# Altium project PDB_Board.PrjPcb
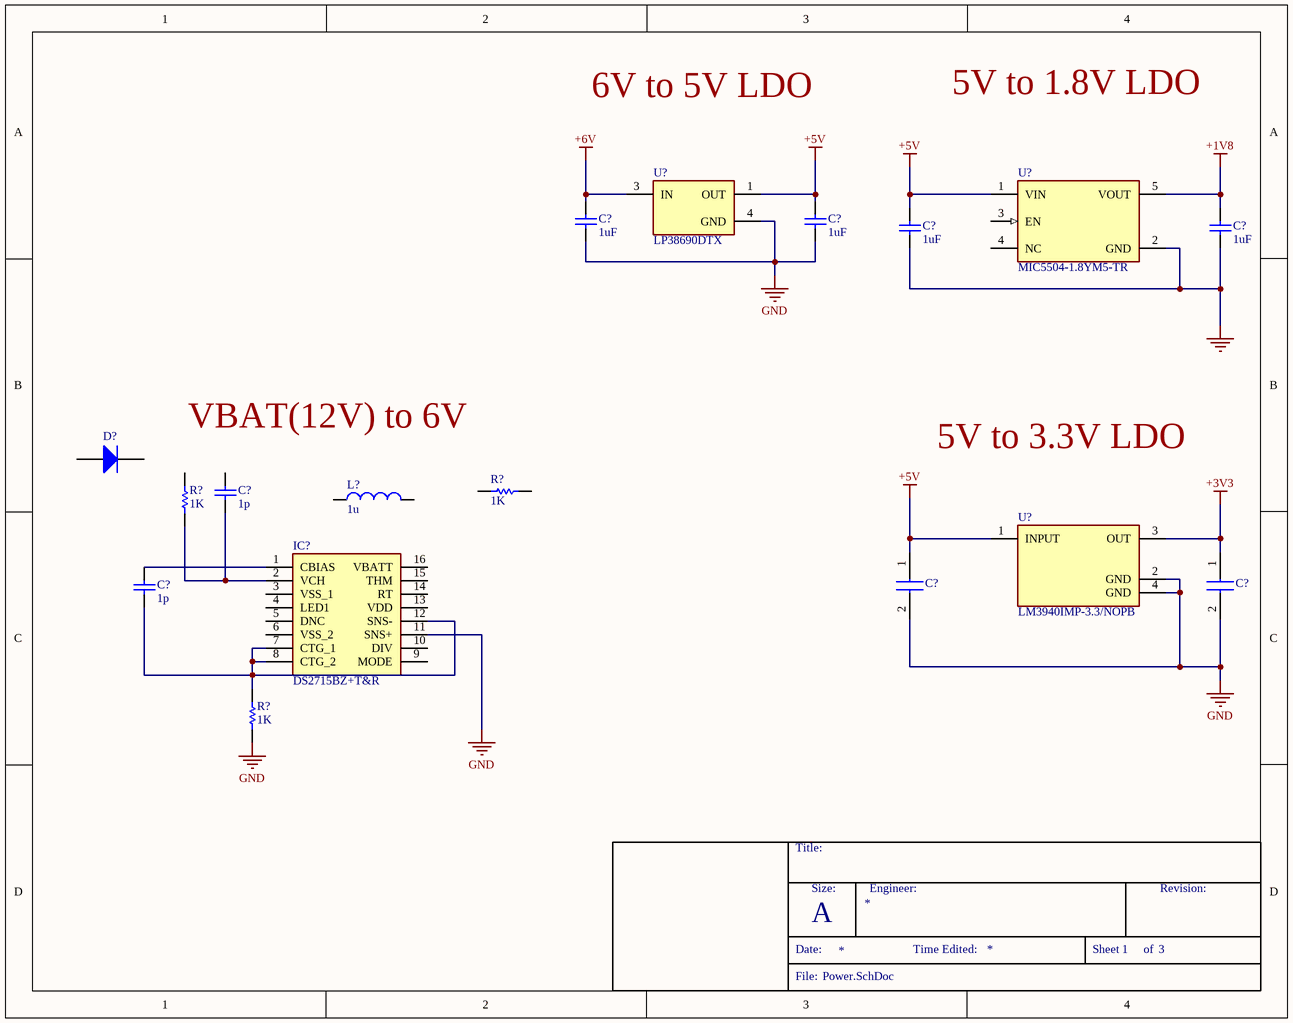
[diagram p0: Power.SchDoc]
CAGE_CODE: ?????; CONTRACT_NUMBER: <CONTRACT NO>; DOC_NO_ASSY_DWG: <ASSY DWG NO>; DOC_NO_BOM: <BOM DOC NO>; DOC_NO_FAB_DWG: <FAB DWG NO>; DOC_NO_SCH_DWG: <SCH DWG NO>; PCB_2_DEC_TOL: +/-.01; PCB_3_DEC_TOL: +/-.010; PCB_ANG_TOL: +/-1/2; PCB_ASSEMBLY_NO: <PCB ASSY NO>; PCB_CHECKER: - -----; PCB_CHECKER_APP_DATE: --/--/----; PCB_DESIGNER: - -----; PCB_DESIGNER_APP_DATE: --/--/----; PCB_DWG_NO: <PCB DWG NO>; PCB_ENGINEER: - -----; PCB_ENGINEER_APP_DATE: --/--/----; PCB_PART_NUMBER: <PCB PN>; PCB_REV: A; SCH_REV: A
3 sheets, 52 parts. Net scope: global (net labels, ports and power ports of the same name join across sheets).
Board file: Power_PCB.PcbDoc
Sheets:
  Power.SchDoc
  Battery.SchDoc
  PDB_Connectors.SchDoc

## Sheet Power.SchDoc
size A; ENG_APP_DATE: --/--/--; DSN_APP_DATE: --/--/--; CHK_APP_DATE: --/--/--; Organization: My Company; Address1: Address Line 1; Address2: Address Line 2; Address3: Address Line 3; Address4: Address Line 4; SheetNumber: 1; SheetTotal: 3

### Parts
(Parts that share a designator on the sheet are numbered #1, #2 ... from top to bottom, then left to right.)
C?#1  1uF  [CAPC1608X87X35LL15T15]
C?#2  1uF  [CAPC1608X87X35LL15T15]
C?#3  1uF  [CAPC1608X87X35LL15T15]
C?#4  1uF  [CAPC1608X87X35LL15T15]
C?#5  value 1p  (hidden comment: Capacitor)
C?#6  C2012X5R0J336M125AC  [CAPC2012X145N]  (value not drawn)
C?#7  C2012X5R0J336M125AC  [CAPC2012X145N]  (value not drawn)
C?#8  value 1p  (hidden comment: Capacitor)
D?#1  Diode  (value not drawn)
IC?#1  DS2715BZ+T&R  [SOIC127P1032X265-16N]
L?#1  value 1u  (hidden comment: Inductor)
R?#1  value 1K  (hidden comment: Resistor)
R?#2  value 1K  (hidden comment: Resistor)
R?#3  value 1K  (hidden comment: Resistor)
U?#1  LP38690DTX  [FP-NDP0003B-MFG]
U?#2  MIC5504-1.8YM5-TR  [FP-SOT23-5LD-PL-1-MFG]
U?#3  LM3940IMP-3.3/NOPB  [FP-DCY0004A-MFG]

### Nets
+1V8: C?#4.2 U?#2.5(VOUT)
+3V3: C?#7.1 U?#3.3(OUT)
+5V: C?#2.2 C?#3.2 C?#6.1 U?#1.1(OUT) U?#2.1(VIN) U?#3.1(INPUT)
+6V: C?#1.2 U?#1.3(IN)
GND: C?#1.1 C?#2.1 C?#3.1 C?#4.1 C?#6.2 C?#7.2 IC?#1.11(SNS+) R?#3.1 U?#1.4(GND) U?#2.2(GND) U?#3.2(GND) U?#3.4(GND)
NetC?#5_1: C?#5.1 IC?#1.2(VCH) R?#2.1
NetC?#8_1: C?#8.1 IC?#1.7(CTG_1) IC?#1.8(CTG_2) IC?#1.12(SNS-) R?#3.2
NetC?#8_2: C?#8.2 IC?#1.1(CBIAS)

Not connected (* = marked no-connect by the designer): C?#5 2; D?#1 1(A) 2(K); IC?#1 3(VSS_1) 4(LED1) 5(DNC) 6(VSS_2) 9(MODE) 10(DIV) 13(VDD) 14(RT) 15(THM) 16(VBATT); L?#1 1 2; R?#1 1 2; R?#2 2; U?#2 3(EN) 4(NC)

### Notes on the sheet
- 6V to 5V LDO
- 5V to 1.8V LDO
- VBAT(12V) to 6V
- 5V to 3.3V LDO
- Title:
- Size:
- Engineer:
- Revision:
- Date:
- A
- Time Edited:
- Sheet
- of
- File:

### Library data of the parts
C?#1-C?#4 = CMP-2006-03713-1: Part Number: C0603C105K3RACTU; Manufacturer: Kemet
C?#5 C?#8 = Capacitor: SimulationGenericComponent: True
C?#6 C?#7 = C2012X5R0J336M125AC: Capacitor; Manufacturer_Name: TDK; Datasheet Link: https://product.tdk.com/info/en/catalog/datasheets/mlcc_commercial_midvoltage_en.pdf; Height: 1.45mm; Manufacturer_Part_Number: C2012X5R0J336M125AC; Mouser Part Number: 810-C2012X5R0J336M; Mouser Price/Stock: https://www.mouser.co.uk/ProductDetail/TDK/C2012X5R0J336M125AC?qs=dfay7wIA1uEz8IOrvQUw5Q%3D%3D; Arrow Part Number: C2012X5R0J336M125AC; Arrow Price/Stock: https://www.arrow.com/en/products/c2012x5r0j336m125ac/tdk?region=nac
D?#1 = Diode: AF: 1; BV: 0; BV_MAX: 1e99; EG: 1.11; FC: 0.5; IBV: 0.001; ISR: 1e-14; MJSW: 0.33; NTUN: 30; TNOM: 27; XTI: 3; SimulationGenericComponent: True; CJO: 0; CJP: 0; CTA: 0; CTP: 0; FCS: 0.5; FV_MAX: 1e99; IKF: 0; IKR: 0; JSW: 0; JTUN: 0; JTUNSW: 0; KEG: 1; KF: 0; LEVEL: 1; N: 1; NBV: 1; NR: 1; NS: 1; PHP: 1; RS: 0; TCV: 0; TLEV: 0; TLEVC: 0; TM1: 0; TM2: 0; TPB: 0; TPHP: 0; TRS: 0; TRS2: 0; TT: 0; TTT1: 0; TTT2: 0; VJ: 1; XTITUN: 3; IS: 1e-14
IC?#1 = DS2715BZ+T&R: Integrated Circuit; Manufacturer_Name: Analog Devices; Datasheet Link: https://www.mouser.in/datasheet/2/256/DS2715-1389140.pdf; Height: 2.65mm; Manufacturer_Part_Number: DS2715BZ+T&R; Mouser Part Number: 700-DS2715BZT&R; Mouser Price/Stock: https://www.mouser.co.uk/ProductDetail/Maxim-Integrated/DS2715BZ%2bTR?qs=LHmEVA8xxfZnvZMuot3c2Q%3D%3D
L?#1 = Inductor: SimulationGenericComponent: True
R?#1-R?#3 = Resistor: TC1: 0; SimulationGenericComponent: True; TC2: 0
U?#1 = CMP-04917-000019-1: IC REG LINEAR 3.3V 1A TO252-3 / LP38690DTX-3.3_NOPB; Manufacturer: Texas Instruments; Manufacturer Part Number: LP38690DTX-3.3/NOPB; Max Junction Temp: +125°C; Nominal Supply Current: 55uA; Number Of Outputs: 1; Dropout Voltage: 650mV; Standoff Height: 0.17mm; Accuracy Percentage: 2.5%; Max Supply Voltage: 10V; Min Supply Voltage: 2.7V; Output Type: Fixed; Digikey Description: IC REG LINEAR 3.3V 1A TO252-3; Device Class L1: Integrated Circuits (ICs); Mouser Description: LDO Voltage Regulators 1A LDO CMOS Linear Regs Stable; Device Class L3: Voltage Regulators - Linear; Output Voltage: 3.3V; Lead Free: Yes; ComponentLink2Description: Datasheet; Height: 2.72mm; Temperature Range Low: -40°C; Temperature: -40°C to +125°C; Device Class L2: Power Management ICs; Temperature Range High: +125°C; RoHS: TRUE; Octopart: https://octopart.com/lp38690dtx-3.3%2Fnopb-texas+instruments-24816519; Automotive: No; Category: IC; Output Current: 1A; Package: NDP0003B; ComponentLink2URL: http://www.ti.com/lit/ds/symlink/lp38690.pdf
U?#2 = CMP-06324-000021-1: IC REG LINEAR 1.8V 300MA SOT23-5; Manufacturer: Microchip; Dropout Voltage: 160mV; Number Of Outputs: 1; Nominal Supply Current: 38-42uA; Accuracy Percentage: 2%; Max Supply Voltage: 5.5V; Max Junction Temp: +125°C; Min Supply Voltage: 2.5V; Standoff Height: 0mm; Output Type: Fixed; Temperature Range Low: -40°C; Temperature Range High: +125°C; Automotive: No; Octopart: https://octopart.com/mic5504-1.8ym5-tr-microchip-66803399; RoHS: TRUE; Device Class L1: Integrated Circuits (ICs); Device Class L3: Voltage Regulators - Linear; Package: SOT23-5LD-PL-1; Device Class L2: Power Management ICs; Output Current: 300mA; Digikey Description: IC REG LINEAR 1.8V 300MA SOT23-5; Lead Free: Yes; Output Voltage: 1.8V; Height: 1.45mm; Category: IC; ComponentLink2Description: Datasheet; Temperature: -40°C to +125°C; ComponentLink2URL: http://ww1.microchip.com/downloads/en/DeviceDoc/MIC5501-02-03-04-300mA-Single-Output-LDO-in-Small-Packages-DS20006006B.pdf; Manufacturer Part Number: MIC5504-1.8YM5-TR
U?#3 = CMP-0062-01788-4: IC REG LINEAR 3.3V 1A SOT223-4; Min Input Voltage: 4.5V; Max Supply Voltage: 7.5V; Number of Outputs: 1; Output Type: Fixed; Polarity: Positive; Dropout Voltage: 500mV; Quiescent Current: 15mA; Max Output Voltage: 3.3V; Length: 6.5mm; Termination: SMD/SMT; Width: 3.56mm; Min Supply Voltage: 4.5V; Max Output Current: 1A; Case/Package: SOT-223; Output Voltage: 3.3V; Current Rating: 1A; Packaging: Tape and Reel; Lead Free: Lead Free; Nominal Output Voltage: 3.3V; Height: 1.6mm; Series: -; Output Configuration: Positive; Radiation Hardening: No; Number of Regulators: 1; Package Quantity: 1000; REACH SVHC: No SVHC; Max Input Voltage: 7.5V; Max Operating Temperature: 125°C; Min Operating Temperature: -40°C; Output Current: 1A; Contact Plating: Tin; Number of Pins: 4; Mount: Surface Mount

## Sheet Battery.SchDoc
size A4; Engineer1: Fabian Hernandez; Engineer2: Jason Kim; Engineer3: Amirtha Chandrasekaran; Engineer4: Kevin Thai; Organization: My Company; Address1: Address Line 1; Address2: Address Line 2; Address3: Address Line 3; Address4: Address Line 4; SheetNumber: 2; SheetTotal: 3
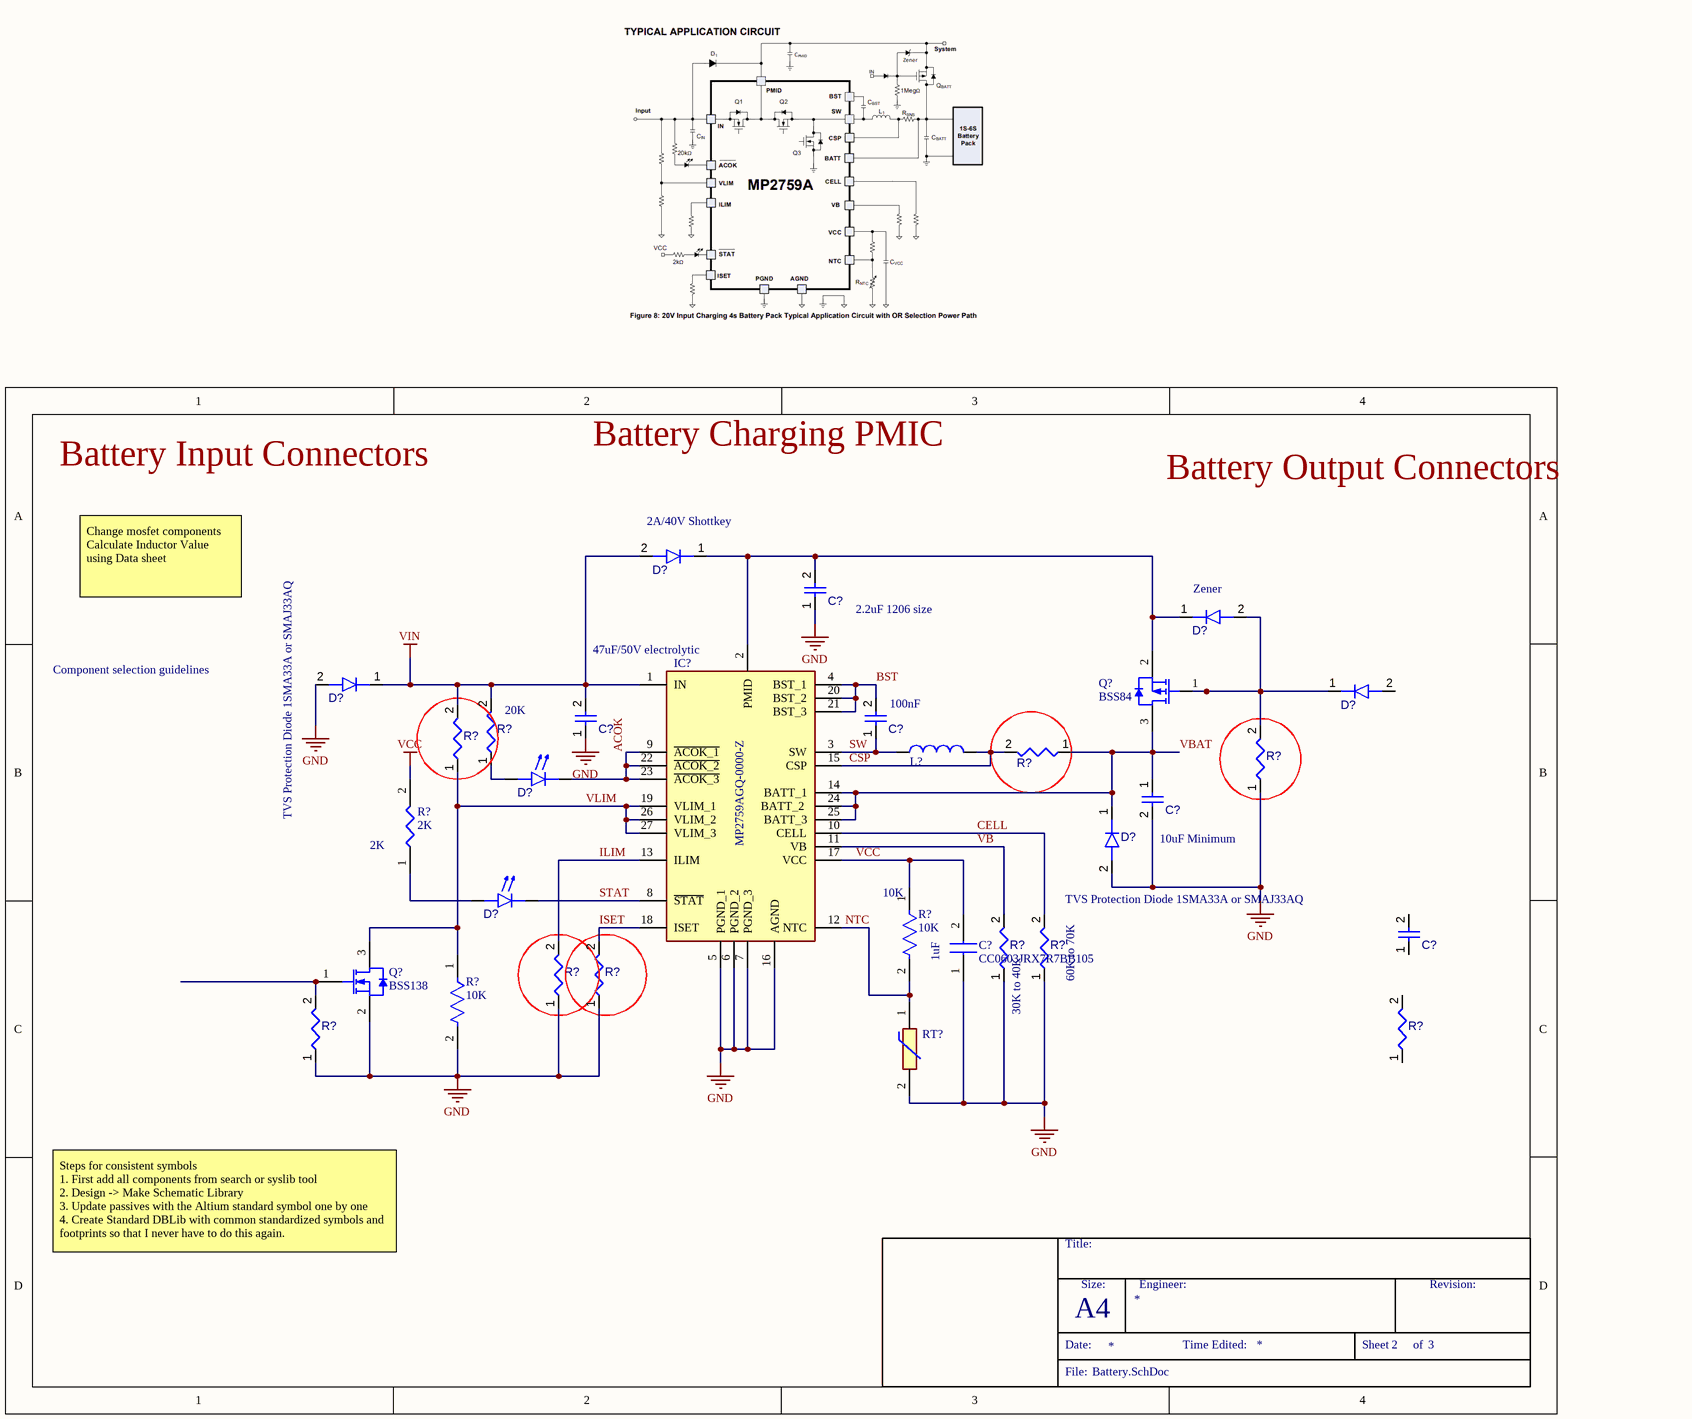
[diagram p1: Battery.SchDoc]

### Parts
(Parts that share a designator on the sheet are numbered #1, #2 ... from top to bottom, then left to right.)
C?#9  Capacitors  (value not drawn)
C?#10  Capacitors  (value not drawn)
C?#11  Capacitors  (value not drawn)
C?#12  Capacitors  (value not drawn)
C?#13  Capacitors  (value not drawn)
C?#14  CC0603JRX7R7BB105  [CAPC1608X90N]
D?#2  Diodes  (value not drawn)
D?#3  Diodes  (value not drawn)
D?#4  Diodes  (value not drawn)
D?#5  Diodes  (value not drawn)
D?#6  LED  (value not drawn)
D?#7  Diodes  (value not drawn)
D?#8  LED  (value not drawn)
IC?#2  MP2759AGQ-0000-Z  [MP2759GQ0000P]
L?#2  Inductors  (value not drawn)
Q?#1  BSS84  [FAIR-SOT23-3_V]
Q?#2  BSS138  [FAIR-SOT23-3_V]
R?#4  Resistors  (value not drawn)
R?#5  Resistors  (value not drawn)
R?#6  Resistors  (value not drawn)
R?#7  Resistors  (value not drawn)
R?#8  2K  [RESC5025X70N]
R?#9  10K  [FP-CRGCQ2010-IPC_C]
R?#10  10K  [FP-CRGCQ2010-IPC_C]
R?#11  Resistors  (value not drawn)
R?#12  Resistors  (value not drawn)
R?#13  Resistors  (value not drawn)
R?#14  Resistors  (value not drawn)
R?#15  Resistors  (value not drawn)
R?#16  Resistors  (value not drawn)
RT?  NTCS0805E3103FLT  [THRMC2012X95N]  (value not drawn)

### Nets
GND: C?#9.1 C?#10.1 C?#12.2 C?#14.1 D?#4.2(A) D?#7.2(A) IC?#2.5(PGND_1) IC?#2.6(PGND_2) IC?#2.7(PGND_3) IC?#2.16(AGND) Q?#2.2(S) R?#7.1 R?#10.2 R?#11.1 R?#12.1 R?#13.1 R?#14.1 R?#15.1 RT?.2
VCC: C?#14.2 IC?#2.17(VCC) R?#8.2 R?#9.1
VIN: C?#10.2 D?#2.2(A) D?#4.1(K) IC?#2.1(IN) R?#5.2 R?#6.2
ACOK: D?#6.1(K) IC?#2.9(~{ACOK_1}) IC?#2.22(~{ACOK_2}) IC?#2.23(~{ACOK_3})
BST: C?#11.2 IC?#2.4(BST_1) IC?#2.20(BST_2) IC?#2.21(BST_3)
CELL: IC?#2.10(CELL) R?#12.2
CSP: IC?#2.15(CSP) L?#2.2 R?#4.2
ILIM: IC?#2.13(ILIM) R?#13.2
ISET: IC?#2.18(ISET) R?#14.2
NTC: IC?#2.12(NTC) R?#9.2 RT?.1
STAT: D?#8.1(K) IC?#2.8(~{STAT})
SW: C?#11.1 IC?#2.3(SW) L?#2.1
VB: IC?#2.11(VB) R?#11.2
VBAT: C?#12.1 D?#7.1(K) IC?#2.14(BATT_1) IC?#2.24(BATT_2) IC?#2.25(BATT_3) Q?#1.3(DRAIN) R?#4.1
VLIM: IC?#2.19(VLIM_1) IC?#2.26(VLIM_2) IC?#2.27(VLIM_3) Q?#2.3(D) R?#6.1 R?#10.1
NetC?#9_2: C?#9.2 D?#2.1(K) D?#3.1(K) IC?#2.2(PMID) Q?#1.2(SOURCE)
NetD?#3_2: D?#3.2(A) D?#5.1(K) Q?#1.1(GATE) R?#7.2
NetD?#6_2: D?#6.2(A) R?#5.1
NetD?#8_2: D?#8.2(A) R?#8.1
NetQ?#2_1: Q?#2.1(G) R?#15.2

Not connected (* = marked no-connect by the designer): C?#13 1 2; D?#5 2(A); R?#16 1 2

### Notes on the sheet
- Battery Input Connectors
- Battery Charging PMIC
- Battery Output Connectors
- (near D?#2) 2A/40V Shottkey
- Change mosfet components
  Calculate Inductor Value using Data sheet
- (near C?#9) 2.2uF 1206 size
- (near D?#3) Zener
- Component selection guidelines
- (near IC?#2) 47uF/50V electrolytic
- (near R?#5) 20K
- (near C?#11) 100nF
- (near D?#4) TVS Protection Diode 1SMA33A or SMAJ33AQ
- (near R?#8) 2K
- (near R?#9) 10K
- TVS Protection Diode 1SMA33A or SMAJ33AQ
- (near C?#12) 10uF Minimum
- 1uF
- (near R?#11) 30K to 40K
- (near R?#12) 60K to 70K
- Steps for consistent symbols
  1. First add all components from search or syslib tool
  2. Design -> Make Schematic Library
  3. Update passives with the Altium standard symbol one by one
  4. Create Standard DBLib with common standardized symbols and footprints so that I never have to do this again.
- Title:
- Size:
- Engineer:
- Revision:
- Date:
- A4
- Time Edited:
- Sheet
- of
- File:

### Library data of the parts
C?#9-C?#13 = Capacitors: Capacitor; Component Type: Capacitors
C?#14 = CC0603JRX7R7BB105: Capacitor; Manufacturer_Name: KEMET; Datasheet Link: https://datasheet.datasheetarchive.com/originals/distributors/Datasheets_SAMA/d9f127a4875522309d99aa7dec79633c.pdf; Height: 0.9mm; Manufacturer_Part_Number: CC0603JRX7R7BB105; Mouser Part Number: 603-CC0603JRX77BB105; Mouser Price/Stock: https://www.mouser.com/Search/Refine.aspx?Keyword=603-CC0603JRX77BB105; Arrow Part Number: CC0603JRX7R7BB105; Arrow Price/Stock: https://www.arrow.com/en/products/cc0603jrx7r7bb105/yageo
D?#2-D?#5 D?#7 = Diodes: Diode; Component Type: Diodes
D?#6 D?#8 = LED: Light-emitting Diode; Component Type: LED
IC?#2 = MP2759AGQ-0000-Z: Integrated Circuit; Manufacturer_Name: Monolithic Power Systems (MPS); Datasheet Link: https://www.mouser.com/datasheet/2/277/MP2759AGQ-2888162.pdf; Height: 1mm; Manufacturer_Part_Number: MP2759AGQ-0000-Z; Mouser Part Number: 946-MP2759AGQ-0000-Z; Mouser Price/Stock: https://www.mouser.co.uk/ProductDetail/Monolithic-Power-Systems-MPS/MP2759AGQ-0000-Z?qs=Rp5uXu7WBW%2F6%252BI1hHvcUXg%3D%3D
Q?#1 = CMP-013-00022-4: P-Channel Enhancement Mode Field-Effect Transistor, 0.13 A, 50 V, -55 to 150 degC, 3-Pin SOT23, RoHS, Tape and Reel; Manufacturer: Fairchild; Nominal Vgs: -1.7V; Typical Rise Time: 6.3ns; Input Capacitance: 73pF; Rds On Max: 10Ohm; Elements: 1; Package Version: Rev. 12, 03/2016; Nominal Dual Supply Voltage: -50V; Power: 360mW; Package Quantity: 3000; Mounting Technology: SM; Package Reference: SOT23-3; Case/Package: TO-236-3; Package Description: 3-Pin Small Outline Transistor, Body 2.92 x 1.325 mm, Pitch 0.95 mm; Datasheet URL: https://www.fairchildsemi.com/datasheets/BS/BSS84.pdf; Packaging: TapeandReel; Max Operating Temperature: 150°C; Min Operating Temperature: -55°C; Pins: 3; Datasheet Version: Rev. 1.1.0, 02/2013; RoHS Compliant: True
Q?#2 = CMP-013-00021-4: N-Channel Logic Level Enhancement Mode Field Effect Transistor, 220 mA, 50 V, -55 to 150 degC, 3-Pin SOT-23, RoHS, Tape and Reel; Manufacturer: Fairchild; Elements: 1; Nominal Vgs: 1.3V; Resistance: 0.7Ohm; Typical Rise Time: 9ns; Rds On Max: 3.5Ohm; Nominal Dual Supply Voltage: 50V; Input Capacitance: 27pF; Package Version: Rev. 12, 03/2016; Power: 360mW; Packaging: TapeandReel; Package Description: 3-Pin Small Outline Transistor, Body 2.92 x 1.325 mm, Pitch 0.95 mm; Datasheet URL: https://www.fairchildsemi.com/datasheets/BS/BSS138.pdf; Min Operating Temperature: -55°C; Pins: 3; RoHS Compliant: True; Package Reference: SOT23-3; Package Quantity: 1; Case/Package: TO-236-3; Mounting Technology: SM; Max Operating Temperature: 150°C; Datasheet Version: Rev. C, 10/2005
R?#4-R?#7 R?#11-R?#16 = Resistors: Resistor; Component Type: Resistors
R?#8 = CRCW20102K00FKEFHP: Resistor CRCW20102K00FKEFHP; Manufacturer_Name: Vishay; Datasheet Link: http://www.vishay.com/docs/20043/crcwhpe3.pdf; Height: 0.7mm; Manufacturer_Part_Number: CRCW20102K00FKEFHP; Mouser Part Number: 71-CRCW20102K00FKEFH; Mouser Price/Stock: https://www.mouser.co.uk/ProductDetail/Vishay-Dale/CRCW20102K00FKEFHP?qs=k2%2FDWSARqgHGhBn8H3HYDw%3D%3D; Arrow Part Number: CRCW20102K00FKEFHP; Arrow Price/Stock: https://www.arrow.com/en/products/crcw20102k00fkefhp/vishay
R?#9 R?#10 = CMP-03211-005335-1: CRGCQ2010 10KΩ 0.75W ±100ppm/°C 1% 200V; Manufacturer: TE Connectivity; Manufacturer Part Number: CRGCQ2010F10K; Automotive Grade: Grade 0; Tolerance: 0.01; Temperature Coefficient: ±100ppm/°C; Value: 10KΩ; Octopart: https://octopart.com/crgcq2010f10k-te+connectivity-91018452; Automotive: Yes; Temperature Range Low: -55°C; Resistance: 10KΩ; Height: 0.65mm; Lead Free: Yes; Category: Res; Temperature: -55°C to +155°C; Composition: Thick Film; ComponentLink2Description: Datasheet; Temperature Range High: +155°C; Device Class L3: Chip SMD Resistors; Voltage Rating: 200V; Package: CRGCQ2010; Device Class L2: Resistors; RoHS: TRUE; Series: CRGCQ; ComponentLink2URL: https://www.te.com/commerce/DocumentDelivery/DDEController?Action=showdoc&DocId=Data+Sheet%7F1773204-3%7F1%7Fpdf%7FEnglish%7FENG_DS_1773204-3_1.pdf%7F4-2176347-922; Ambient Temperature Range High: +70°C; Device Class L1: Passive Components; Power Rating: 0.75W; Ipc Land Pattern Name: RESC500250X55
RT? = NTCS0805E3103FLT: Thermistor; Manufacturer_Name: Vishay; Datasheet Link: http://www.vishay.com/docs/29044/ntcs0805e3t.pdf; Height: 0.95mm; Manufacturer_Part_Number: NTCS0805E3103FLT; Mouser Part Number: 594-NTCS0805E3103FLT; Mouser Price/Stock: https://www.mouser.co.uk/ProductDetail/Vishay-BC-Components/NTCS0805E3103FLT?qs=%2FWiulJ9oly4Pd4lidS66Yw%3D%3D; Arrow Part Number: NTCS0805E3103FLT; Arrow Price/Stock: https://www.arrow.com/en/products/ntcs0805e3103flt/vishay
L?#2 = Inductors: Component Type: Inductors

## Sheet PDB_Connectors.SchDoc
size A; Engineer1: Fabian Hernandez; Engineer2: Jason Kim; Engineer3: Amirtha Chandrasekaran; Engineer4: Kevin Thai; Organization: My Company; Address1: Address Line 1; Address2: Address Line 2; Address3: Address Line 3; Address4: Address Line 4
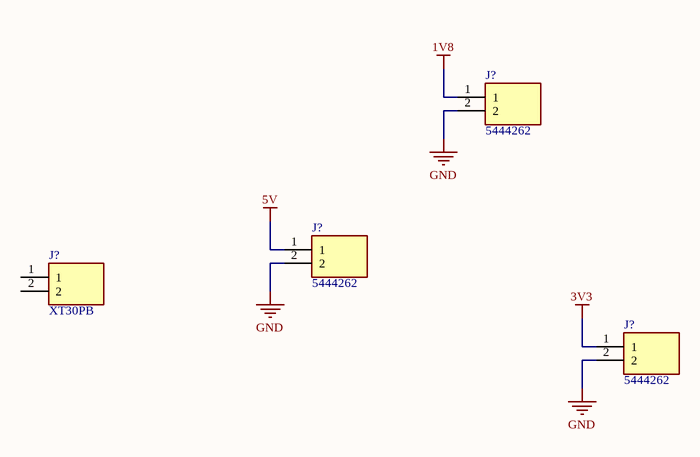
[diagram p2: PDB_Connectors.SchDoc]

### Parts
(Parts that share a designator on the sheet are numbered #1, #2 ... from top to bottom, then left to right.)
J?#1  5444262  [SHDR2W80P0X381_1X2_901X920X740P]
J?#2  5444262  [SHDR2W80P0X381_1X2_901X920X740P]
J?#3  XT30PB  [XT30PB]
J?#4  5444262  [SHDR2W80P0X381_1X2_901X920X740P]

### Nets
1V8: J?#1.1
3V3: J?#4.1
5V: J?#2.1
GND: J?#1.2 J?#2.2 J?#4.2

Not connected (* = marked no-connect by the designer): J?#3 1 2

### Notes on the sheet
- Title:
- Size:
- Engineer:
- Revision:
- Date:
- A
- Time Edited:
- Sheet
- of
- File:

### Library data of the parts
J?#1 J?#2 J?#4 = 5444262: Connector; Manufacturer_Name: Phoenix Contact; Datasheet Link: https://datasheet.datasheetarchive.com/originals/distributors/Datasheets-DGA25/1829481.pdf; Height: 7.4mm; Manufacturer_Part_Number: 5444262; Mouser Part Number: 651-5444262; Mouser Price/Stock: https://www.mouser.co.uk/ProductDetail/Phoenix-Contact/5444262?qs=9Y9qB%2FCsC3lS%2FxAVKTDcmQ%3D%3D; Arrow Part Number: 5444262; Arrow Price/Stock: https://www.arrow.com/en/products/5444262/phoenix-contact?region=nac
J?#3 = XT30PB: Connector; Manufacturer_Name: Amass; Datasheet Link: https://www.tme.eu/Document/4acc913878197f8c2e30d4b8cdc47230/XT30UPB%20SPEC.pdf; Height: 10.7mm; Manufacturer_Part_Number: XT30PB

## Nets that join several sheets
GND: Power (12 pins), Battery (19 pins), PDB_Connectors (J?#1.2 J?#2.2 J?#4.2)